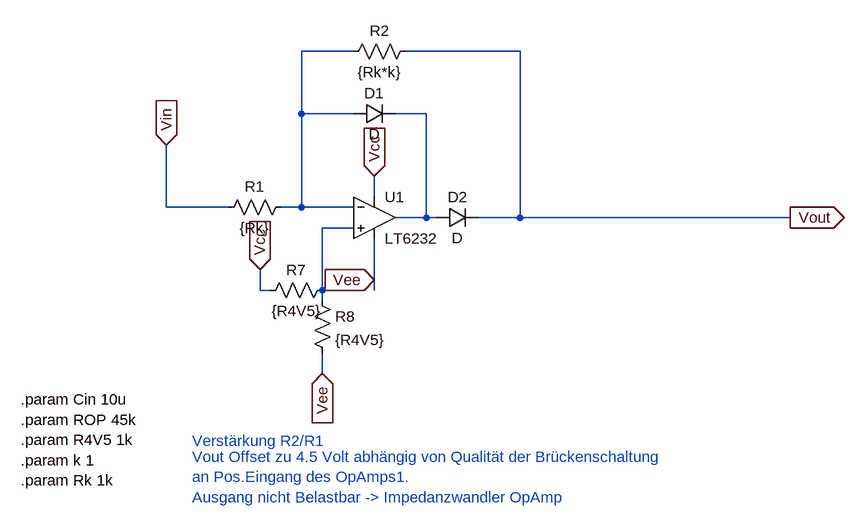
[diagram p0: schematic PraezEinwegGleichrichter.asc]
PraezEinwegGleichrichter.asc, the LTspice schematic file:
Version 4
SHEET 1 1296 680
WIRE 128 -80 48 -80
WIRE 384 -80 208 -80
WIRE 48 16 48 -80
WIRE 128 16 48 16
WIRE 240 16 192 16
WIRE 160 144 160 112
WIRE -160 160 -160 64
WIRE -64 160 -160 160
WIRE 48 160 48 16
WIRE 48 160 16 160
WIRE 128 160 48 160
WIRE 240 176 240 16
WIRE 240 176 192 176
WIRE 256 176 240 176
WIRE 384 176 384 -80
WIRE 384 176 320 176
WIRE 800 176 384 176
WIRE 128 192 80 192
WIRE 160 272 160 208
WIRE -16 288 -16 256
WIRE 0 288 -16 288
WIRE 80 288 80 192
WIRE 160 288 160 272
WIRE 80 304 80 288
WIRE 80 416 80 384
FLAG 160 112 Vcc
IOPIN 160 112 In
FLAG 160 272 Vee
IOPIN 160 272 In
FLAG -16 256 Vcc
IOPIN -16 256 In
FLAG 80 416 Vee
IOPIN 80 416 In
FLAG -160 64 Vin
IOPIN -160 64 In
FLAG 800 176 Vout
IOPIN 800 176 Out
SYMBOL Opamps\\LT6232 160 176 R0
SYMATTR InstName U1
SYMBOL res -80 176 R270
WINDOW 0 32 56 VTop 2
WINDOW 3 0 56 VBottom 2
SYMATTR InstName R1
SYMATTR Value {Rk}
SYMBOL res 112 -64 R270
WINDOW 0 32 56 VTop 2
WINDOW 3 0 56 VBottom 2
SYMATTR InstName R2
SYMATTR Value {Rk*k}
SYMBOL res -16 304 R270
WINDOW 0 32 56 VTop 2
WINDOW 3 0 56 VBottom 2
SYMATTR InstName R7
SYMATTR Value {R4V5}
SYMBOL res 64 288 R0
SYMATTR InstName R8
SYMATTR Value {R4V5}
SYMBOL diode 128 32 R270
WINDOW 0 32 32 VTop 2
WINDOW 3 0 32 VBottom 2
SYMATTR InstName D1
SYMBOL diode 256 192 R270
WINDOW 0 32 32 VTop 2
WINDOW 3 0 32 VBottom 2
SYMATTR InstName D2
TEXT -120 520 Left 2 ;Verstärkung R2/R1
TEXT -120 544 Left 2 ;Vout Offset zu 4.5 Volt abhängig von Qualität der Brückenschaltung \nan Pos.Eingang des OpAmps1.\nAusgang nicht Belastbar -> Impedanzwandler OpAmp
TEXT -384 456 Left 2 !.param Cin 10u\n.param ROP 45k\n.param R4V5 1k\n.param k 1\n.param Rk 1k

The netlist it stands for:
* PraezEinwegGleichrichter.asc
* U1: LT6232 (symbol Opamps\LT6232 not available, pins judged from their places): In+=N003 In-=N001 V+=Vcc V-=Vee OUT=N002
R1 Vin N001 {Rk}
R2 N001 Vout {Rk*k}
R7 Vcc N003 {R4V5}
R8 N003 Vee {R4V5}
D1 N001 N002 D
D2 N002 Vout D
.model D D
.lib standard.dio
* Verstärkung R2/R1
* Vout Offset zu 4.5 Volt abhängig von Qualität der Brückenschaltung
* an Pos.Eingang des OpAmps1.
* Ausgang nicht Belastbar -> Impedanzwandler OpAmp
.param Cin 10u
.param ROP 45k
.param R4V5 1k
.param k 1
.param Rk 1k
.backanno
.end